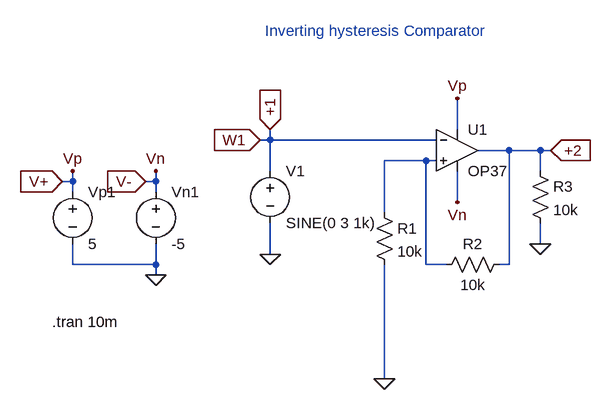
[diagram p0: schematic inv_hys_comp.asc]
inv_hys_comp.asc, the LTspice schematic file:
Version 4
SHEET 1 880 680
WIRE -656 112 -656 64
WIRE -944 128 -944 112
WIRE -944 128 -960 128
WIRE -688 128 -944 128
WIRE -576 144 -624 144
WIRE -528 144 -576 144
WIRE -512 144 -528 144
WIRE -704 160 -768 160
WIRE -688 160 -704 160
WIRE -944 176 -944 128
WIRE -528 176 -528 144
WIRE -1248 192 -1248 176
WIRE -1248 192 -1264 192
WIRE -1120 192 -1120 176
WIRE -1120 192 -1136 192
WIRE -1248 208 -1248 192
WIRE -1120 208 -1120 192
WIRE -656 224 -656 176
WIRE -768 240 -768 160
WIRE -528 288 -528 256
WIRE -944 304 -944 256
WIRE -1248 320 -1248 288
WIRE -1120 320 -1120 288
WIRE -1120 320 -1248 320
WIRE -704 320 -704 160
WIRE -672 320 -704 320
WIRE -576 320 -576 144
WIRE -576 320 -592 320
WIRE -1120 336 -1120 320
WIRE -768 496 -768 320
FLAG -768 496 0
FLAG -656 224 Vn
FLAG -656 64 Vp
FLAG -528 288 0
FLAG -944 304 0
FLAG -960 128 W1
IOPIN -960 128 In
FLAG -944 112 +1
IOPIN -944 112 In
FLAG -512 144 +2
IOPIN -512 144 In
FLAG -1120 336 0
FLAG -1248 176 Vp
FLAG -1120 176 Vn
FLAG -1264 192 V+
IOPIN -1264 192 In
FLAG -1136 192 V-
IOPIN -1136 192 In
SYMBOL voltage -944 160 R0
WINDOW 123 0 0 Left 0
WINDOW 39 0 0 Left 0
SYMATTR InstName V1
SYMATTR Value SINE(0 3 1k)
SYMBOL res -544 160 R0
SYMATTR InstName R3
SYMATTR Value 10k
SYMBOL res -784 224 R0
SYMATTR InstName R1
SYMATTR Value 10k
SYMBOL res -576 304 R90
WINDOW 0 0 56 VBottom 2
WINDOW 3 32 56 VTop 2
SYMATTR InstName R2
SYMATTR Value 10k
SYMBOL Opamps\\OP37 -656 80 R0
SYMATTR InstName U1
SYMBOL voltage -1120 192 R0
WINDOW 123 0 0 Left 0
WINDOW 39 0 0 Left 0
SYMATTR InstName Vn1
SYMATTR Value -5
SYMBOL voltage -1248 192 R0
WINDOW 123 0 0 Left 0
WINDOW 39 0 0 Left 0
SYMATTR InstName Vp1
SYMATTR Value 5
TEXT -952 -40 Left 2 ;Inverting hysteresis Comparator
TEXT -1280 408 Left 2 !.tran 10m

The netlist it stands for:
* inv_hys_comp.asc
V1 +1 0 SINE(0 3 1k)
R3 +2 0 10k
R1 N001 0 10k
R2 +2 N001 10k
XU1 N001 +1 V+ V- +2 LT1037  ; OP37, pins In+ In- V+ V- OUT
Vn1 V- 0 -5
Vp1 V+ 0 5
* Inverting hysteresis Comparator
.tran 10m
.lib LTC.lib
.backanno
.end